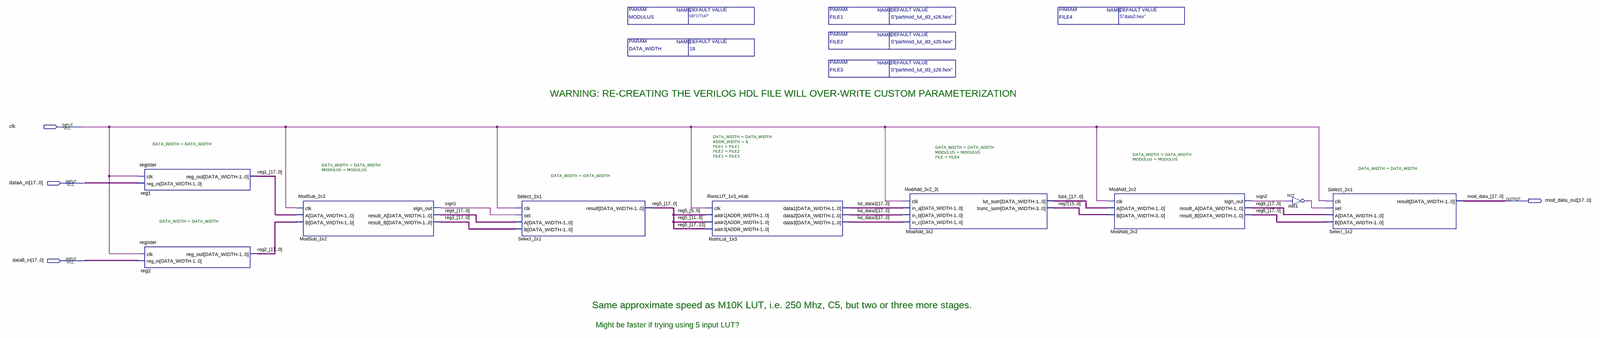
[diagram p0: schematic sheet, whole]
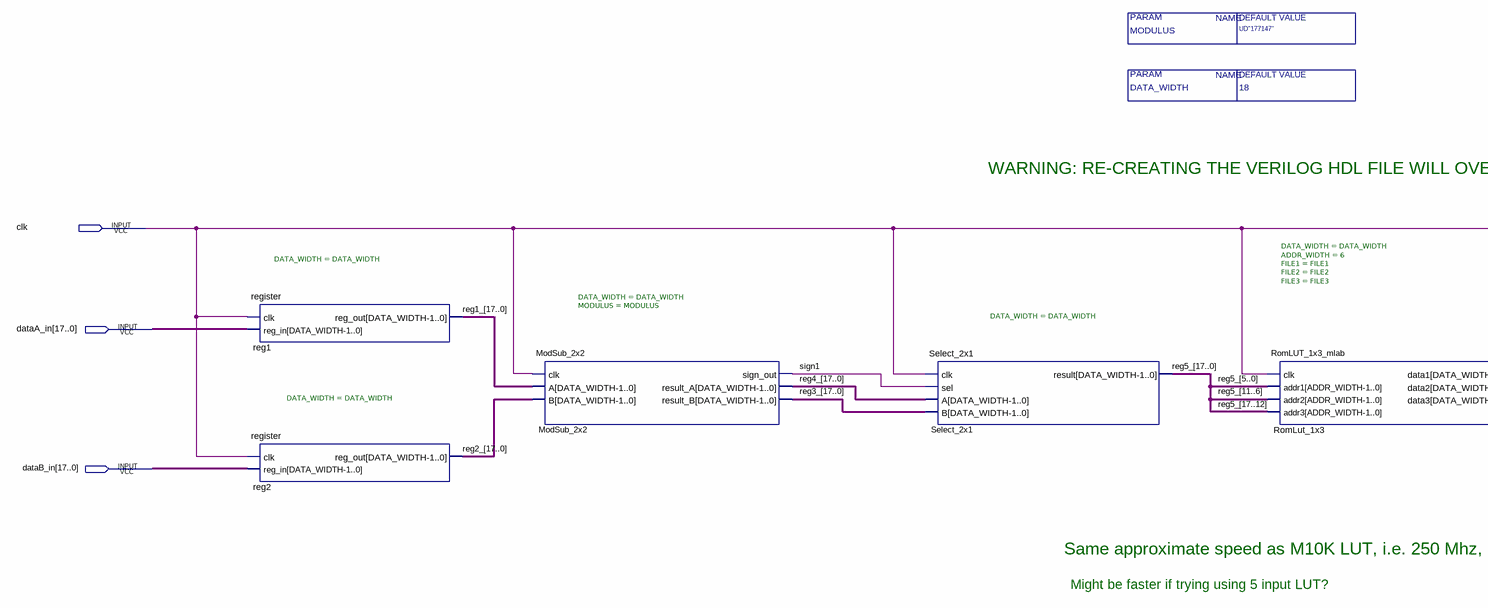
[diagram p1: schematic sheet, left part]
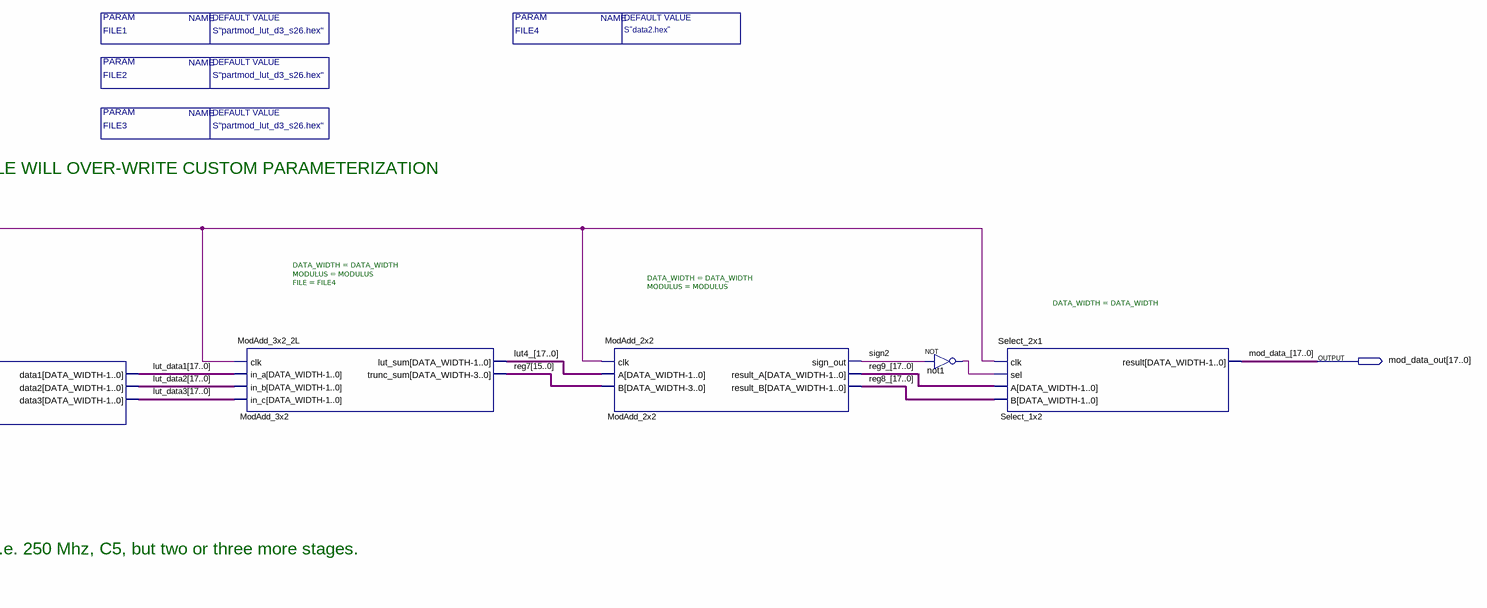
[diagram p2: schematic sheet, right part]
// Quartus schematic SubInvMult_8L_mlab.bdf as structural Verilog: 9 symbols, 4 pins
module SubInvMult_8L_mlab #(parameter FILE1 = "S\"partmod_lut_d3_s26.hex\"", parameter FILE2 = "S\"partmod_lut_d3_s26.hex\"", parameter FILE3 = "S\"partmod_lut_d3_s26.hex\"", parameter FILE4 = "S\"data2.hex\"", parameter MODULUS = "UD\"177147\"", parameter DATA_WIDTH = 18) (
  input  clk,
  input  [17:0] dataA_in,
  input  [17:0] dataB_in,
  output [17:0] mod_data_out
);

  wire not1_out, sign1, sign2;
  wire [15:0] reg7;
  wire [17:0] lut4_, lut_data1, lut_data2, lut_data3, reg1_, reg2_, reg3_, reg4_, reg5_, reg8_, reg9_;

  register #(.DATA_WIDTH(DATA_WIDTH)) reg1 (.clk(clk), .reg_in(dataA_in), .reg_out(reg1_));
  register #(.DATA_WIDTH(DATA_WIDTH)) reg2 (.clk(clk), .reg_in(dataB_in), .reg_out(reg2_));
  ModSub_2x2 #(.DATA_WIDTH(DATA_WIDTH), .MODULUS(MODULUS)) ModSub_2x2 (
    .clk(clk), .A(reg1_), .B(reg2_), .sign_out(sign1), .result_A(reg4_), .result_B(reg3_));
  Select_2x1 #(.DATA_WIDTH(DATA_WIDTH)) Select_2x1 (.clk(clk), .sel(sign1), .A(reg4_), .B(reg3_), .result(reg5_));
  RomLUT_1x3_mlab #(.DATA_WIDTH(DATA_WIDTH), .ADDR_WIDTH(6), .FILE1(FILE1), .FILE2(FILE2), .FILE3(FILE3)) RomLut_1x3 (
    .clk(clk), .addr1(reg5_[5:0]), .addr2(reg5_[11:6]), .addr3(reg5_[17:12]), .data1(lut_data1),
    .data2(lut_data2), .data3(lut_data3));
  ModAdd_3x2_2L #(.DATA_WIDTH(DATA_WIDTH), .MODULUS(MODULUS), .FILE(FILE4)) ModAdd_3x2 (
    .clk(clk), .in_a(lut_data1), .in_b(lut_data2), .in_c(lut_data3), .lut_sum(lut4_), .trunc_sum(reg7));
  ModAdd_2x2 #(.DATA_WIDTH(DATA_WIDTH), .MODULUS(MODULUS)) ModAdd_2x2 (
    .clk(clk), .A(lut4_), .B(reg7), .sign_out(sign2), .result_A(reg9_), .result_B(reg8_));
  not not1 (not1_out, sign2);
  Select_2x1 #(.DATA_WIDTH(DATA_WIDTH)) Select_1x2 (
    .clk(clk), .sel(not1_out), .A(reg9_), .B(reg8_), .result(mod_data_out));

  // Other names for the same wires on the sheet: mod_data_[17:0] = mod_data_out

  // Notes on the sheet:
  //   WARNING: RE-CREATING THE VERILOG HDL FILE WILL OVER-WRITE CUSTOM PARAMETERIZATION
  //   Same approximate speed as M10K LUT, i.e. 250 Mhz, C5, but two or three more stages.
  //   Might be faster if trying using 5 input LUT?
endmodule
